# Altium schematic sheet Sensors and display.SchDoc
size A3; SheetNumber: 3; SheetTotal: 4
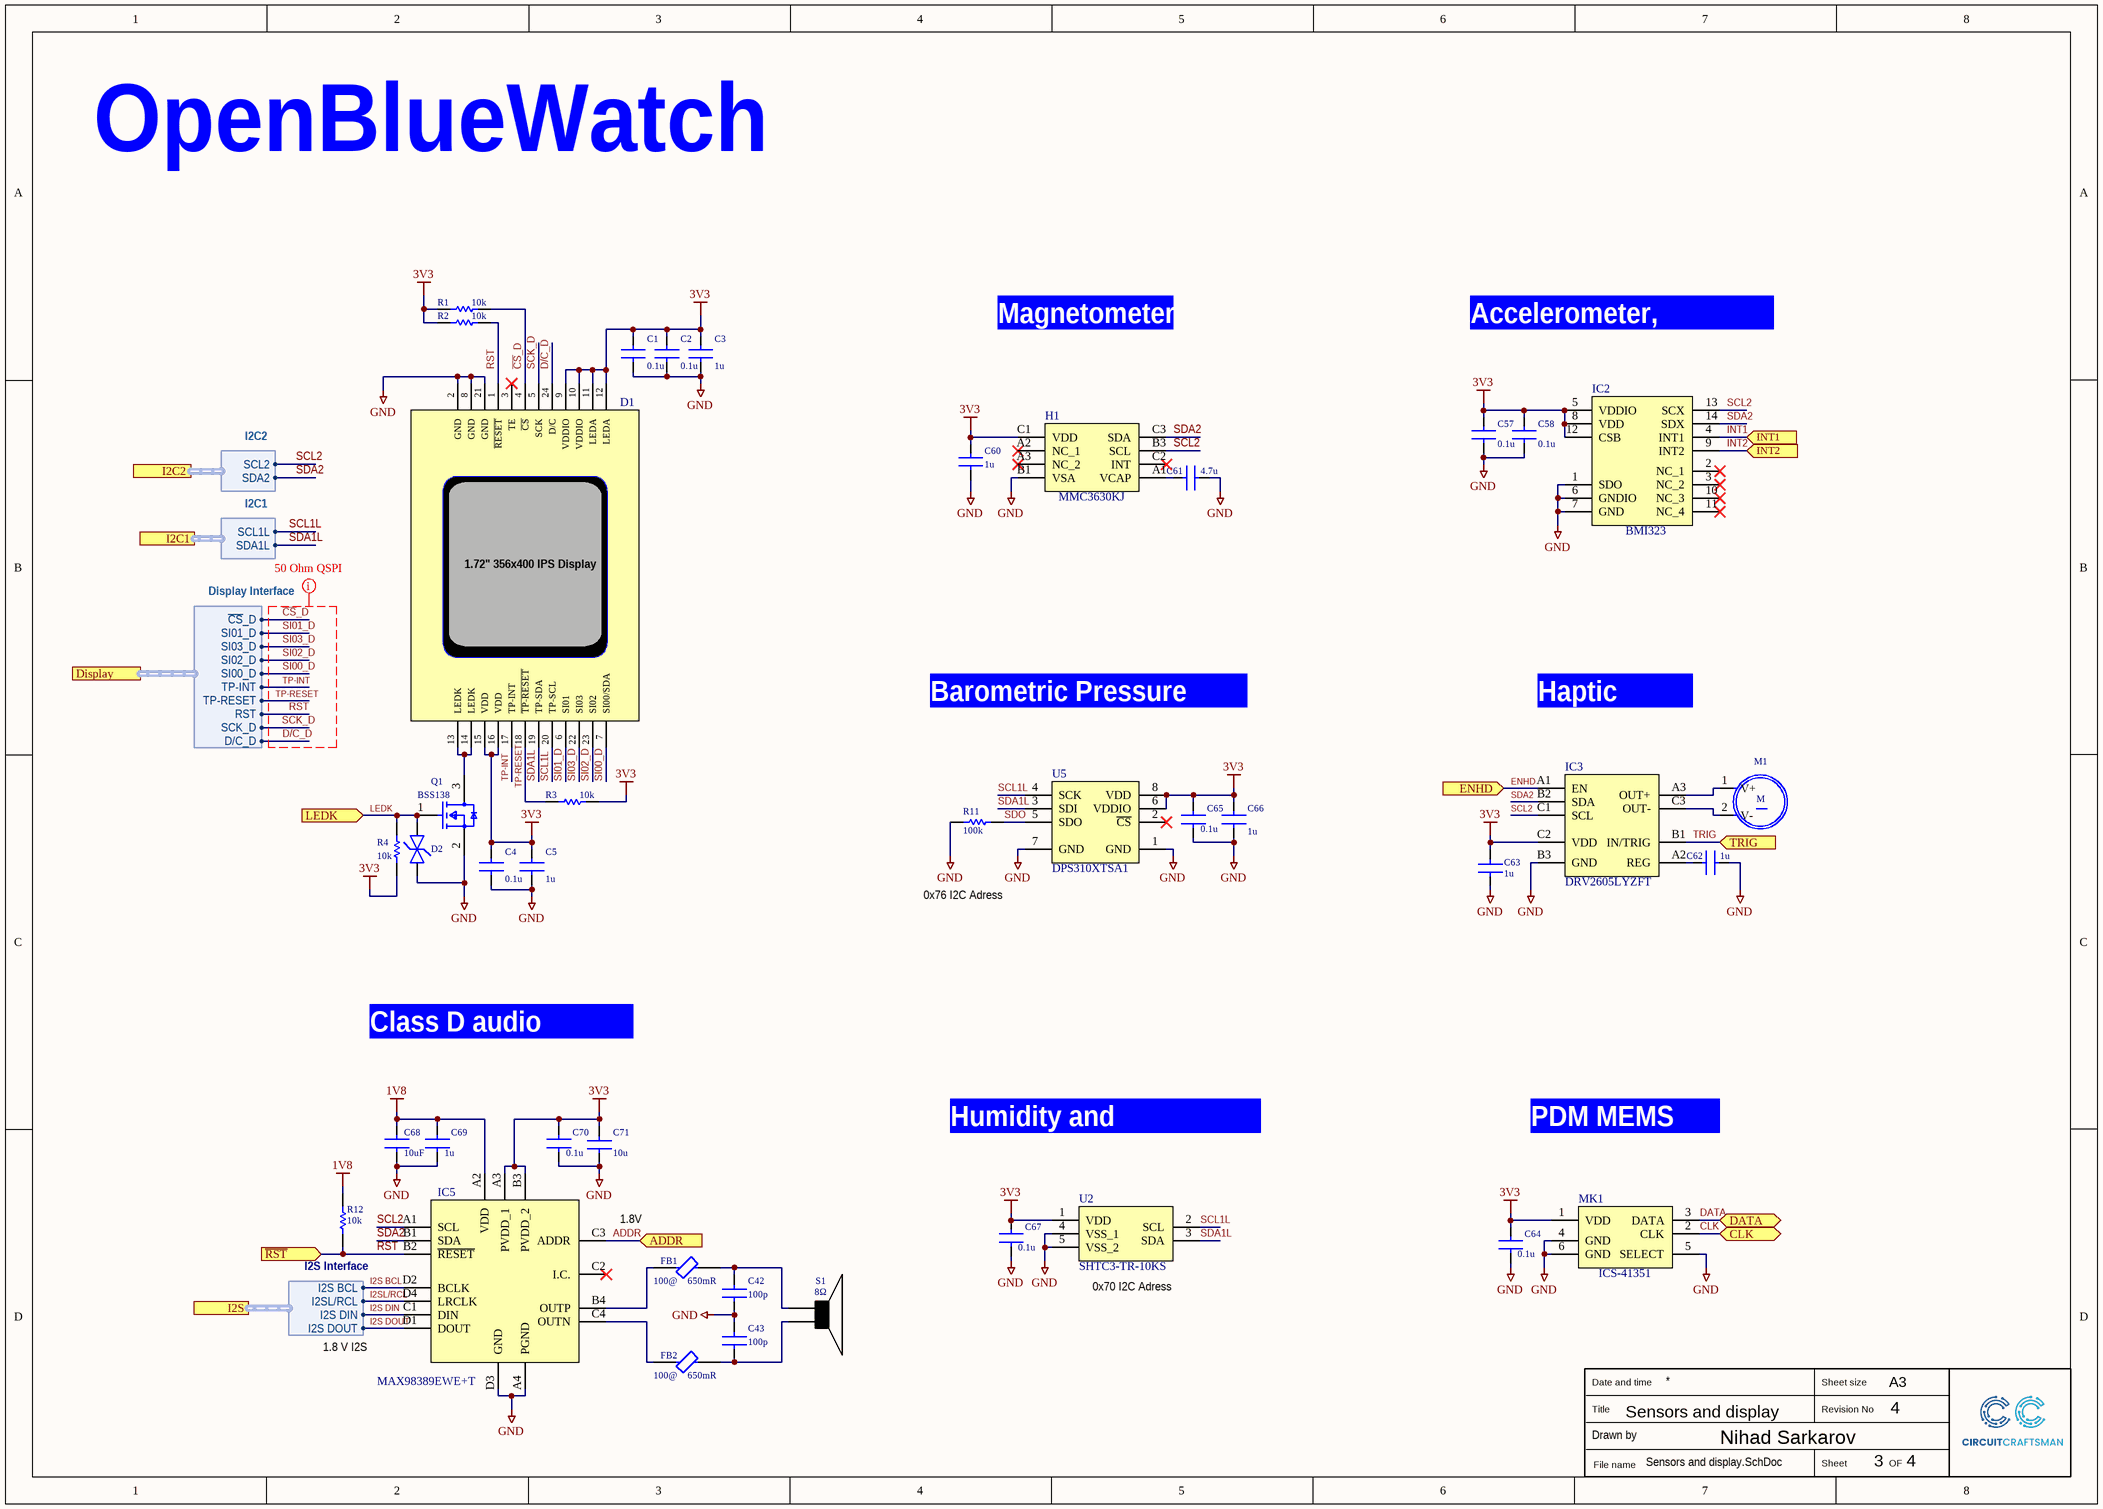
[diagram p0: Sensors and display.SchDoc]

## Parts
C1  value 0.1u  [FP-CC0402-IPC_C]  (hidden comment: CC0402KRX7R7BB104)
C2  value 0.1u  [FP-CC0402-IPC_C]  (hidden comment: CC0402KRX7R7BB104)
C3  value 1u  [FP-CC0402-IPC_C]  (hidden comment: CC0402KRX7R7BB104)
C4  value 0.1u  [FP-CC0402-IPC_C]  (hidden comment: CC0402KRX7R7BB104)
C5  value 1u  [FP-CC0402-IPC_C]  (hidden comment: CC0402KRX7R7BB104)
C42  value 100p  [FP-CC0201-BA-MFG]  (hidden comment: CC0201KRX7R8BB102)
C43  value 100p  [FP-CC0201-BA-MFG]  (hidden comment: CC0201KRX7R8BB102)
C57  value 0.1u  [FP-CC0201-BA-MFG]  (hidden comment: CC0201KRX7R8BB102)
C58  value 0.1u  [FP-CC0201-BA-MFG]  (hidden comment: CC0201KRX7R8BB102)
C60  value 1u  [FP-CC0402-IPC_C]  (hidden comment: CC0402KRX7R7BB104)
C61  value 4.7u  [FP-CC0402-IPC_C]  (hidden comment: CC0402KRX7R7BB104)
C62  value 1u  [FP-CC0402-IPC_C]  (hidden comment: CC0402KRX7R7BB104)
C63  value 1u  [FP-CC0402-IPC_C]  (hidden comment: CC0402KRX7R7BB104)
C64  value 0.1u  [FP-CC0201-BA-MFG]  (hidden comment: CC0201KRX7R8BB102)
C65  value 0.1u  [FP-CC0201-BA-MFG]  (hidden comment: CC0201KRX7R8BB102)
C66  value 1u  [FP-CC0402-IPC_C]  (hidden comment: CC0402KRX7R7BB104)
C67  value 0.1u  [FP-CC0201-BA-MFG]  (hidden comment: CC0201KRX7R8BB102)
C68  value 10uF  [FP-CC0402-IPC_C]  (hidden comment: CC0402KRX7R7BB104)
C69  value 1u  [FP-CC0201-BA-MFG]  (hidden comment: CC0201KRX7R8BB102)
C70  value 0.1u  [FP-CC0201-BA-MFG]  (hidden comment: CC0201KRX7R8BB102)
C71  Capacitance: 10u  [FP-C1608-080-0_1-MFG]  (hidden comment: C1608X7R1E105K080AB)
D1  1.72" 356x400 IPS Display  [CONN-SMD_24P-P0.40_X0400FVS-24-LPSN]
D2  PGB1010402KR  [FP-PGB1-0402-IPC_A]  (value not drawn)
FB1  DC Resistance (DCR): 650mR  Frequency: 100@  [FP-BLM15-0_05-IPC_A]  (hidden comment: BLM15AG102SN1D)
FB2  DC Resistance (DCR): 650mR  Frequency: 100@  [FP-BLM15-0_05-IPC_A]  (hidden comment: BLM15AG102SN1D)
H1  MMC3630KJ  [BGA8C40P3X3_120X120X57]
IC2  BMI323  [BMI323]
IC3  DRV2605LYZFT  [BGA9C50P3X3_144X144X62]
IC5  MAX98389EWE+T  [BGA16C40P4X4_179X164X69]
M1  NFP-WS0625  [NFP-WS0625]  (value not drawn)
MK1  ICS-41351  [MIC_ICS-41351]
Q1  BSS138  [FP-318-08-IPC_B]
R1  Resistance: 10k  [RESC0603X28X15LL5T05]  (hidden comment: CRCW02010000Z0ED)
R2  Resistance: 10k  [RESC0603X28X15LL5T05]  (hidden comment: CRCW02010000Z0ED)
R3  Resistance: 10k  [RESC0603X28X15LL5T05]  (hidden comment: CRCW02010000Z0ED)
R4  Resistance: 10k  [RESC0603X28X15LL5T05]  (hidden comment: CRCW02010000Z0ED)
R11  Resistance: 100k  [RESC0603X28X15LL5T05]  (hidden comment: CRCW02010000Z0ED)
R12  Resistance: 10k  [RESC0603X28X15LL5T05]  (hidden comment: CRCW02010000Z0ED)
S1  Impedance: 8Ω  [CMS-15118D-L100]  (hidden comment: CMS-15118D-L100)
U2  SHTC3-TR-10KS  [SHTC3TR10KS]
U5  DPS310XTSA1  [FP-PG-VLGA-8-MFG]

## Ports
ADDR (in, see MCU[2B]), CLK (bidir, see MCU[2B]), DATA (bidir, see MCU[2B]), Display (harness Display Interface, see MCU[1B]), ENHD (in, see MCU[2B]), I2C1 (harness I2C1, see MCU[5D]), I2C2 (harness I2C2, see MCU[1B]), I2S (harness I2S Interface, see MCU[1B]), INT1 (in, see MCU[4A]), INT2 (in, see MCU[4C]), LEDK (in, see MCU[2A]), TRIG (in, see MCU[2B]), ~{RST} (in, see MCU[2B])

## Harnesses
I2S Interface: I2S BCL, I2SL/RCL, I2S DIN, I2S DOUT
Display Interface: ~{CS}_D, SI01_D, SI03_D, SI02_D, SI00_D, TP-INT, TP-RESET, RST, SCK_D, D/C_D
I2C1: SCL1L, SDA1L
I2C2: SCL2, SDA2

## Nets
1V8: C68.1 C69.1 IC5.A2(VDD) R12.1
3V3: C1.1 C2.1 C3.1 C4.1 C5.1 C57.1 C58.1 C60.1 C63.2 C64.1 C65.1 C66.1 C67.1 C70.1 C71.2 D1.9(VDDIO) D1.10(VDDIO) D1.11(LEDA) D1.12(LEDA) D1.15(VDD) D1.16(VDD) H1.C1(VDD) IC2.5(VDDIO) IC2.8(VDD) IC2.12(CSB) IC3.C2(VDD) IC5.A3(PVDD_1) IC5.B3(PVDD_2) MK1.1(VDD) R1.2 R2.2 R3.2 R4.2 U2.1(VDD) U5.6(VDDIO) U5.8(VDD)
GND: C1.2 C2.2 C3.2 C4.2 C5.2 C42.1 C43.2 C57.2 C58.2 C60.2 C61.2 C62.2 C63.1 C64.2 C65.2 C66.2 C67.2 C68.2 C69.2 C70.2 C71.1 D1.2(GND) D1.8(GND) D1.21(GND) D2.2 H1.B1(VSA) IC2.1(SDO) IC2.6(GNDIO) IC2.7(GND) IC3.B3(GND) IC5.A4(PGND) IC5.D3(GND) MK1.4(GND) MK1.5(SELECT) MK1.6(GND) Q1.2(S) R11.2 U2.4(VSS_1) U2.5(VSS_2) U5.1(GND) U5.7(GND)
ADDR: IC5.C3(ADDR) ; port ADDR
~{CS}_D: D1.4(~{CS}) R1.1 ; port Display.~{CS}_D
CLK: MK1.2(CLK) ; port CLK
D/C_D: D1.24(D/C) ; port Display.D/C_D
DATA: MK1.3(DATA) ; port DATA
ENHD: IC3.A1(EN) ; port ENHD
I2S BCL: IC5.D2(BCLK) ; port I2S.I2S BCL
I2S DIN: IC5.C1(DIN) ; port I2S.I2S DIN
I2S DOUT: IC5.D1(DOUT) ; port I2S.I2S DOUT
I2SL/RCL: IC5.D4(LRCLK) ; port I2S.I2SL/RCL
INT1: IC2.4(INT1) ; port INT1
INT2: IC2.9(INT2) ; port INT2
LEDK: D2.1 Q1.1(G) R4.1 ; port LEDK
~{RST}: IC5.B2(~{RESET}) R12.2 ; port ~{RST}
RST: D1.1(~{RESET}) R2.1 ; port Display.RST
SCK_D: D1.5(SCK) ; port Display.SCK_D
SCL1L: D1.20(TP-SCL) U2.2(SCL) U5.4(SCK) ; port I2C1.SCL1L
SCL2: H1.B3(SCL) IC2.13(SCX) IC3.C1(SCL) IC5.A1(SCL) ; port I2C2.SCL2
SDA1L: D1.19(TP-SDA) U2.3(SDA) U5.3(SDI) ; port I2C1.SDA1L
SDA2: H1.C3(SDA) IC2.14(SDX) IC3.B2(SDA) IC5.B1(SDA) ; port I2C2.SDA2
SDO: R11.1 U5.5(SDO)
SI00_D: D1.7(SI00/SDA) ; port Display.SI00_D
SI01_D: D1.6(SI01) ; port Display.SI01_D
SI02_D: D1.23(SI02) ; port Display.SI02_D
SI03_D: D1.22(SI03) ; port Display.SI03_D
TP-INT: D1.17(TP-INT) ; port Display.TP-INT
TP-RESET: D1.18(~{TP-RESET}) R3.1 ; port Display.TP-RESET
TRIG: IC3.B1(IN/TRIG) ; port TRIG
NetC42_2: C42.2 FB1.2 S1.1(+)
NetC43_1: C43.1 FB2.2 S1.2(-)
NetC61_1: C61.1 H1.A1(VCAP)
NetC62_1: C62.1 IC3.A2(REG)
NetD1_13: D1.13(LEDK) D1.14(LEDK) Q1.3(D)
NetFB1_1: FB1.1 IC5.B4(OUTP)
NetFB2_1: FB2.1 IC5.C4(OUTN)
NetIC3_A3: IC3.A3(OUT+) M1.1(V+)
NetIC3_C3: IC3.C3(OUT-) M1.2(V-)

Not connected (* = marked no-connect by the designer): D1 3(TE)*; H1 A2(NC_1)* A3(NC_2)* C2(INT)*; IC2 2(NC_1)* 3(NC_2)* 10(NC_3)* 11(NC_4)*; IC5 C2(I.C.)*; U5 2(~{CS})*

## Layout directives
mark named 50 Ohm QSPI: D/C_D, RST, SCK_D, SI00_D, SI01_D, SI02_D, SI03_D, TP-INT, TP-RESET, ~{CS}_D

## Notes on the sheet
- OpenBlueWatch
- Magnetometer
- Accelerometer, Gyroscope
- Barometric Pressure Sensor
- Haptic Driver
- 0x76 I2C Adress
- Class D audio amplifier
- Humidity and Temperature
- PDM MEMS Mic
- 1.8V
- (near U2) 0x70 I2C Adress
- (near IC5) 1.8 V I2S
- Sensors and display
- 4
- 3
- Date and time
- Sheet size
- A3
- Title
- Drawn by
- File name
- Nihad Sarkarov
- Sheet
- Revision No
- OF
- (in symbol NFP-WS0625) M

## Library data of the parts
C1-C5 C60-C63 C66 C68 = CMP-03422-000048-1: CAP CER  X7R 0402; Manufacturer: YAGEO; Material: Ceramic; Automotive Grade: NA; Temperature Coefficient: 30ppm/°C; Voltage Rating: 16 V; Tolerance: 0.1; Device Class L1: Passive Components; Temperature Range Low: -55°C; Device Class L3: Ceramic Capacitors; Temperature Characteristic: X7R; Ipc Land Pattern Name: CAPC10050X50; Temperature Range High: +125°C; Temperature: -55°C to +125°C; RoHS: TRUE; Automotive: No; Height: 0.55mm; Device Class L2: Capacitors; Digikey Description: CAP CER 0.1UF 16V X7R 0402; Package: CC0402; Footprint Url: http://www.yageo.com/exep/pages/download/literatures/UPY-C_GEN_24.pdf; ComponentLink2Description: Datasheet; Category: Cap; Lead Free: Yes; Octopart: https://octopart.com/cc0402krx7r7bb104-yageo-42244624; ComponentLink2URL: http://www.yageo.com/documents/recent/UPY-GP_NP0_16V-to-50V_16.pdf; Manufacturer Part Number: CC0402KRX7R7BB104; Mouser Description: 0402 0.1 uF 16 V ±10 % Tolerance X7R SMT Multilayer Ceramic Capacitor
  C1 C2 C4: Capacitance: 0.1u
  C3 C5 C60 C62 C63 C66: Capacitance: 1u
  C61: Capacitance: 4.7u
  C68: Capacitance: 10uF
C42 C43 C57 C58 C64 C65 C67 C69 C70 = CMP-03422-000456-1: CAP CER X7R 0201; Manufacturer: Yageo; Temperature Coefficient: 15%; Tolerance: 0.1; Voltage Rating: 25 V; Material: Ceramic; Footprint Url: http://www.yageo.com/exep/pages/download/literatures/UPY-C_GEN_24.pdf; Digikey Description: CAP CER 1000PF 25V X7R 0201; ComponentLink2URL: http://www.yageo.com/documents/recent/UPY-GPHC_X5R_4V-to-50V_25.pdf; Manufacturer Part Number: CC0201KRX7R8BB102; Lead Free: Yes; Temperature: -55°C to +85°C; Package: CC0201-BA; Automotive: No; Device Class L1: Passive Components; ComponentLink2Description: Datasheet; Octopart: https://octopart.com/cc0201krx7r8bb102-yageo-9292631; Temperature Range High: +85°C; Device Class L3: Ceramic Capacitors; Temperature Range Low: -55°C; Category: Cap; Device Class L2: Capacitors; Ipc Land Pattern Name: CAPC6030X30; Height: 0.33mm; Temperature Characteristic: X7R; RoHS: TRUE; Mouser Description: Multilayer Ceramic Capacitors MLCC - SMD/SMT 1.0nF 25V X7R 10%
  C42 C43: Capacitance: 100p
  C57 C58 C64 C65 C67 C70: Capacitance: 0.1u
  C69: Capacitance: 1u
C71 = CMP-08246-005723-1: Multilayer Ceramic Capacitors 1μF ±10% 25V X7R SMD 0603; Mount: Surface Mount; Series: C; Tolerance: 10%; RoHS Compliant: Yes; Packaging: Tape and Reel; Case Code (Imperial): 0603; Height: 0.8mm; Case/Package: 0603; REACH SVHC: No SVHC; Thickness: 0.037inch; Voltage: 25V; Voltage Rating (DC): 25V; Construction: Flat; Case Code (Metric): 1608; Radiation Hardening: No; Package Quantity: 4000; Weight: 7.1E-05oz; Width: 0.031inch; Resistor Type: Ceramic; Termination: SMD/SMT; Depth: 0.8mm; Lead Free: Lead Free; Min Operating Temperature: -55°C; Length: 1.6mm; Dielectric: X7R; Max Operating Temperature: 125°C; Voltage Rating: 25V; Dielectric Material: Ceramic
D1 = 1.72" 356*400 IPS Display: 1.72" 356*400 IPS WAE2012 16.7M QSPI B2B Connector / 24 Pin – In Cell Touch; ComponentLink1Description: Supplier name; ComponentLink1URL: ALP Electronix; ComponentLink2Description: Supplier link; ComponentLink2URL: https://alpelectronix.com/product/tft-displays/lcd-172356400-wae2012/
D2 = CMP-2000-05189-2: TVS DIODE 12V 250V 0402; Manufacturer: Littelfuse; Capacitance: 0.04pF; Direction: Bidirectional; Number Of Channels: 1; Value: 0.04pF; Automotive: No; Temperature: -65°C to +125°C; Category: Diode; Device Class L2: TVS Diodes; Temperature Range High: +125°C; Octopart: https://octopart.com/pgb1010402kr-littelfuse-10444990; Temperature Range Low: -65°C; Digikey Description: TVS DIODE 12V 250V 0402; RoHS: TRUE; Lead Free: Yes; Ipc Land Pattern Name: DIOC9951X31; ComponentLink2URL: https://www.littelfuse.com/~/media/electronics/datasheets/pulseguard_esd_suppressors/littelfuse_pulseguard_pgb1_datasheet.pdf.pdf; Manufacturer Part Number: PGB1010402KR; Device Class L1: Circuit Protection; Package: PGB1-0402; Mouser Description: ESD Suppressors / TVS Diodes PULSEGUARD 0402 ESD SUPPRESSOR; Clamping Voltage: 250V; Device Class L3: unset; Height: 0.39mm; ComponentLink2Description: Datasheet
FB1 FB2 = CMP-0686-00181-5: Chip Ferrite Bead, 0402, 1000Ω @ 100MHz, 0.65Ω, 25%, 300mA; DC Current: 200mA; Number of Circuits: 1; Shielding: Unshielded; Impedance: 1kR; DC Resistance-Max: 1R; Packaging: Tape and Reel; Case Code (Imperial): 0402; Military Standard: Not; Min Operating Temperature: -55°C; Width: 0.5mm; Tolerance: 25%; Material: Ferrite; Number of Lines: 1; Max Current Rating: 300mA; Depth: 0.55mm; Package Quantity: 1; Case/Package: 0402; Series: BLM15AG_SN; Case Code (Metric): 1005; Max Operating Temperature: 125°C; Lead Free: Lead Free; Test Frequency: 100MHz; RoHS Compliant: Yes; Radiation Hardening: No; Number of Pins: 2; Core Material: Ferrite; Current Rating: 300mA; Max DC Current: 200mA; REACH SVHC: No SVHC; Length: 1mm; Termination: SMD/SMT; Height: 0.5mm
H1 = MMC3630KJ: MAGNETIC SENSOR 3-AXIS 1.2X1.2MM; Manufacturer_Name: MEMSIC; Datasheet Link: https://www.mouser.es/datasheet/2/821/Memsic_02032020_MMC3630KJ-B_User_Guide-1759765.pdf; Height: 0.57mm; Manufacturer_Part_Number: MMC3630KJ; Mouser Part Number: 438-MMC3630KJ; Mouser Price/Stock: https://www.mouser.co.uk/ProductDetail/MEMSIC/MMC3630KJ?qs=GBLSl2Akirv8DB8M%2FUpnNA%3D%3D; Supplier 1: Digikey; Supplier Part Number 1: 1267-MMC3630KJCT-ND
IC2 = BMI323: Accelerometer, Gyroscope, 6 Axis Sensor I2C, I3C, SPI Output; Manufacturer_Name: BOSCH; Datasheet Link: https://www.bosch-sensortec.com/media/boschsensortec/downloads/datasheets/bst-bmi323-ds000.pdf; Height: 0.87mm; Manufacturer_Part_Number: BMI323; Arrow Part Number: BMI323; Arrow Price/Stock: https://www.arrow.com/en/products/bmi323/bosch?region=nac; DigiKey Part Number: 828-BMI323TR-ND; Part Status: Active; Supplier 1: Future Electronics; Supplier Part Number 1: 1168362
IC3 = DRV2605LYZFT: Motor Driver Power MOSFET I2C 9-DSBGA; Manufacturer_Name: Texas Instruments; Datasheet Link: http://www.ti.com/lit/gpn/DRV2605L; Height: 0.625mm; Manufacturer_Part_Number: DRV2605LYZFT; Mouser Part Number: 595-DRV2605LYZFT; Mouser Price/Stock: https://www.mouser.co.uk/ProductDetail/Texas-Instruments/DRV2605LYZFT?qs=s5SkPsIz10%2FWt6JoX%2FHfsQ%3D%3D; Arrow Part Number: DRV2605LYZFT; Arrow Price/Stock: https://www.arrow.com/en/products/drv2605lyzft/texas-instruments?region=nac; Supplier 1: Digikey; Supplier Part Number 1: 296-37839-1-ND
IC5 = MAX98389EWE+T: Amplifier IC 1-Channel (Mono) Class D 16-WLP (1.64x1.79); Manufacturer_Name: Analog Devices; Datasheet Link: https://www.analog.com/MAX98389/datasheet; Height: 0.69mm; Manufacturer_Part_Number: MAX98389EWE+; Supplier 1: Mouser; Supplier Part Number 1: 700-MAX98389EWE+T
M1 = NFP-WS0625: 6mm Brushless Coin Vibration Motor 2.5mm Type Motor; Rated Voltage: 3V DC; Motor Diameter: 6mm ± 0.05mm; Motor Thickness: 2.5mm ± 0.1mm; Working Current Range: 50mA – 60mA; Rated Speed: 16,000 ± 3,000rpm; Start Voltage: 2.5V max; Wire Length: 50mm ± 2mm; ComponentLink1Description: Link; ComponentLink1URL: https://nfpshop.com/product/6mm-brushless-coin-vibration-motor-2-5mm-type-model-nfp-ws0625
MK1 = ICS-41351: 50 Hz ~ 20 kHz Digital, PDM Microphone MEMS (Silicon) Omnidirectional (-26dB ±1dB @ 94dB SPL) Solder Pads; MF: TDK InvenSense; Package: None; Price: None; Value: *; MP: ICS-41351; Availability: Unavailable; Supplier 1: Mouser; Supplier Part Number 1: 410-ICS-41351
Q1 = CMP-07173-000101-1: MOSFET N-CH 50V 220MA SOT-23; Turn-Off Delay Time: 20ns; Element Configuration: Single; Rds On Max: 3.5R; Gate to Source Voltage (Vgs): 20V; Threshold Voltage: 1.3V; Number of Elements: 1; Power Dissipation: 360mW; Rise Time: 9ns; Turn-On Delay Time: 2.5ns; Input Capacitance: 27pF; On-State Resistance: 6R; Lead Free: Lead Free; Length: 2.92mm; Width: 1.3mm; Drain to Source Breakdown Voltage: 50V; Min Operating Temperature: -55°C; REACH SVHC: No SVHC; Packaging: Tape and Reel; Radiation Hardening: No; Height: 0.93mm; Drain to Source Voltage (Vdss): 50V; Current Rating: 220mA; Voltage Rating (DC): 50V; Weight: 0.03g; Continuous Drain Current (ID): 220mA; Number of Pins: 3; Nominal Vgs: 1.3V; Max Power Dissipation: 360mW; Fall Time: 9ns; Drain to Source Resistance: 3.5R; Contact Plating: Tin; Case/Package: SOT-23; Package Quantity: 1; Dual Supply Voltage: 50V; Mount: Surface Mount; Termination: SMD/SMT; Max Operating Temperature: 150°C
R1-R4 R11 R12 = CMP-2004-00001-2: Chip Resistor, 0 Ohm, 0.05 W, -55 to 155 degC, 0201 (0603 Metric), RoHS, Tape and Reel; Voltage Rating: 30 V; Case\Package: 0201; Tolerance: 5%; Power Rating: 50 mW; REACH SVHC: Unknown; Length: 0.6 mm; Packaging: Cut Tape; Weight: 6E-06 oz; ComponentLink2URL: http://www.vishay.com/docs/20052/crcw0201e3.pdf; Mounting Technology: Surface Mount; Case Code (Imperial): 0201; Radiation Hardening: No; RoHSCompliant: true; Package Quantity: 1; Min Operating Temperature: -55 degC; Height: 0.23 mm; PackageReference: 0201; ComponentLink1Description: Manufacturer URL; ComponentLink2Description: Datasheet; Case Code (Metric): 0603; DatasheetVersion: 03/2016; Width: 0.3 mm; Mount: Surface Mount; PackageDescription: 2-Pin Surface Mount Device, Body 0.6 x 0.3 mm; ComponentLink1URL: http://www.vishay.com/; Max Operating Temperature: 155 degC
S1 = CMS-15118D-L100: 8 Ohms Low Profile Speaker 700 mW 425 Hz ~ 10 kHz Top Rectangular; Supplier 1: Digikey; Supplier Part Number 1: 102-4343-ND
U2 = SHTC3-TR-10KS: Humidity, Temperature 0 ~ 100% RH I2C ±2% RH 8 s Surface Mount; Manufacturer_Name: Sensirion; Voltage - Supply: 1.62V ~ 3.6V; Datasheet Link: https://sensirion.com/media/documents/643F9C8E/63A5A436/Datasheet_SHTC3.pdf; Height: 0.8mm; Manufacturer_Part_Number: SHTC3-TR-10KS; Arrow Part Number: SHTC3-TR-10KS; Arrow Price/Stock: https://www.arrow.com/en/products/shtc3-tr-10ks/sensirion-ag?region=nac; Supplier 1: Digikey; Supplier Part Number 1: 1649-SHTC3-TR-10KSTR-ND; DigiKey Part Number: 1649-SHTC3-TR-10KSTR-ND; Part Status: Active; Sensor Type: Humidity, Temperature
U5 = CMP-32885-000002-2: Pressure Sensor 4.35PSI ~ 17.4PSI (30kPa ~ 120kPa) Absolute 24 b 8-VFLGA; Max Supply Voltage: 3.6V; Interface: I2C; Pressure Type: Vented Gauge; Max Pressure: 145PSI; Output Type: SPI; Operating Pressure: 17.4PSI; Min Operating Temperature: -40°C; Lead Free: Lead Free; Termination: SMD/SMT; Halogen Free: Halogen Free; Case/Package: LGA; Max Operating Temperature: 85°C; Number of Pins: 8; Supplier 1: Mouser; Supplier Part Number 1: 726-DPS310XTSA1